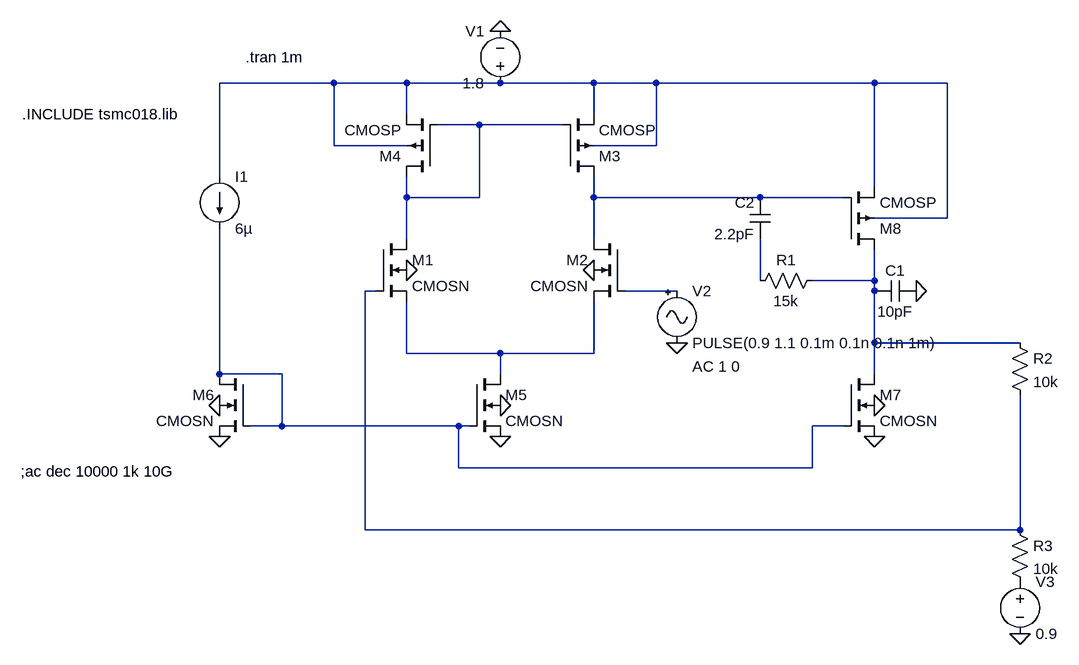
[diagram p0: schematic Closed_loop_240102259.asc]
Closed_loop_240102259.asc, the LTspice schematic file:
Version 4
SHEET 1 1572 1092
WIRE 448 224 272 224
WIRE 560 224 448 224
WIRE 704 224 560 224
WIRE 848 224 704 224
WIRE 944 224 848 224
WIRE 1280 224 944 224
WIRE 1392 224 1280 224
WIRE 560 272 560 224
WIRE 848 272 848 224
WIRE 672 288 608 288
WIRE 800 288 672 288
WIRE 448 320 448 224
WIRE 560 320 448 320
WIRE 944 320 944 224
WIRE 944 320 848 320
WIRE 272 368 272 224
WIRE 1280 384 1280 224
WIRE 560 400 560 368
WIRE 672 400 672 288
WIRE 672 400 560 400
WIRE 848 400 848 368
WIRE 1104 400 848 400
WIRE 1232 400 1104 400
WIRE 1392 432 1392 224
WIRE 1392 432 1280 432
WIRE 560 464 560 400
WIRE 848 464 848 400
WIRE 1104 528 1104 464
WIRE 1280 528 1280 480
WIRE 1280 528 1184 528
WIRE 512 544 496 544
WIRE 976 544 896 544
WIRE 1280 544 1280 528
WIRE 1280 624 1280 544
WIRE 1504 624 1280 624
WIRE 560 640 560 560
WIRE 704 640 560 640
WIRE 848 640 848 560
WIRE 848 640 704 640
WIRE 272 672 272 448
WIRE 368 672 272 672
WIRE 704 672 704 640
WIRE 1280 672 1280 624
WIRE 368 752 368 672
WIRE 368 752 320 752
WIRE 640 752 368 752
WIRE 656 752 640 752
WIRE 1232 752 1184 752
WIRE 640 816 640 752
WIRE 1184 816 1184 752
WIRE 1184 816 640 816
WIRE 496 912 496 544
WIRE 1504 912 1504 704
WIRE 1504 912 496 912
FLAG 704 144 0
FLAG 560 512 0
FLAG 848 512 0
FLAG 272 720 0
FLAG 272 768 0
FLAG 704 768 0
FLAG 704 720 0
FLAG 976 624 0
FLAG 1280 768 0
FLAG 1280 720 0
FLAG 1344 544 0
FLAG 1504 1072 0
SYMBOL cmosn 512 464 R0
SYMATTR InstName M1
SYMATTR Value2 l=1u w=6.5u
SYMBOL cmosn 896 464 M0
SYMATTR InstName M2
SYMATTR Value2 l=1u w=6.5u
SYMBOL voltage 704 240 R180
WINDOW 0 24 96 Left 2
WINDOW 3 24 16 Left 2
WINDOW 123 0 0 Left 2
WINDOW 39 0 0 Left 2
SYMATTR InstName V1
SYMATTR Value 1.8
SYMBOL Misc\\signal 976 528 R0
WINDOW 123 24 132 Left 2
WINDOW 39 0 0 Left 2
SYMATTR Value2 AC 1 0
SYMATTR InstName V2
SYMATTR Value PULSE(0.9 1.1 0.1m 0.1n 0.1n 1m)
SYMBOL cmosp 800 368 M180
SYMATTR InstName M3
SYMATTR Value2 l=1u w=3.57u
SYMBOL cmosp 608 368 R180
SYMATTR InstName M4
SYMATTR Value2 l=1u w=3.57u
SYMBOL cmosn 656 672 R0
SYMATTR InstName M5
SYMATTR Value2 l=2u w=60u
SYMBOL cmosn 320 672 M0
SYMATTR InstName M6
SYMATTR Value2 l=2u w=6u
SYMBOL current 272 368 R0
WINDOW 123 0 0 Left 2
WINDOW 39 0 0 Left 2
SYMATTR InstName I1
SYMATTR Value 6µ
SYMBOL cmosn 1232 672 R0
SYMATTR InstName M7
SYMATTR Value2 l=2u w=60u
SYMBOL cmosp 1232 480 M180
SYMATTR InstName M8
SYMATTR Value2 l=1u w=7.14u
SYMBOL cap 1344 528 R90
WINDOW 0 0 32 VBottom 2
WINDOW 3 32 32 VTop 2
SYMATTR InstName C1
SYMATTR Value 10pF
SYMBOL cap 1120 464 R180
WINDOW 0 24 56 Left 2
WINDOW 3 24 8 Left 2
SYMATTR InstName C2
SYMATTR Value 2.2pF
SYMBOL res 1200 512 R90
WINDOW 0 0 56 VBottom 2
WINDOW 3 32 56 VTop 2
SYMATTR InstName R1
SYMATTR Value 15k
SYMBOL res 1488 608 R0
SYMATTR InstName R2
SYMATTR Value 10k
SYMBOL res 1488 896 R0
SYMATTR InstName R3
SYMATTR Value 10k
SYMBOL voltage 1504 976 R0
WINDOW 123 0 0 Left 2
WINDOW 39 0 0 Left 2
SYMATTR InstName V3
SYMATTR Value 0.9
TEXT -32 272 Left 2 !.INCLUDE tsmc018.lib
TEXT 312 184 Left 2 !.tran 1m
TEXT -34 822 Left 2 !;ac dec 10000 1k 10G

The netlist it stands for:
* Closed_loop_240102259.asc
M1 N002 N006 N008 0 CMOSN l=1u w=6.5u
M2 N003 N007 N008 0 CMOSN l=1u w=6.5u
V1 N001 0 1.8
V2 N007 0 PULSE(0.9 1.1 0.1m 0.1n 0.1n 1m) AC 1 0
M3 N003 N002 N001 N001 CMOSP l=1u w=3.57u
M4 N002 N002 N001 N001 CMOSP l=1u w=3.57u
M5 N008 N009 0 0 CMOSN l=2u w=60u
M6 N009 N009 0 0 CMOSN l=2u w=6u
I1 N001 N009 6µ
M7 N005 N009 0 0 CMOSN l=2u w=60u
M8 N005 N003 N001 N001 CMOSP l=1u w=7.14u
C1 0 N005 10pF
C2 N004 N003 2.2pF
R1 N005 N004 15k
R2 N005 N006 10k
R3 N006 P001 10k
V3 P001 0 0.9
.model NMOS NMOS
.model PMOS PMOS
.lib standard.mos
.INCLUDE tsmc018.lib
.tran 1m
;ac dec 10000 1k 10G
.backanno
.end